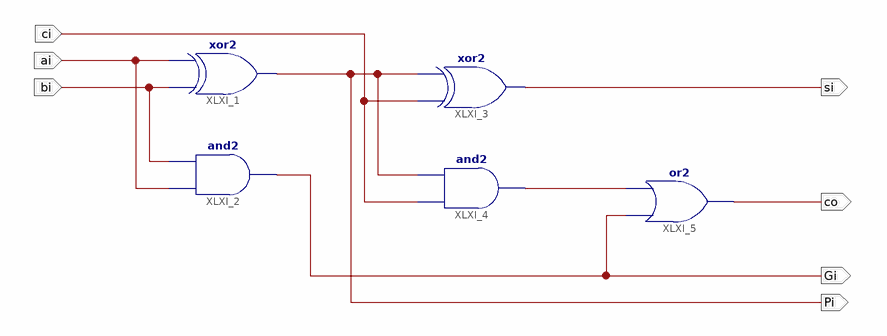
[diagram p0: schematic sheet 1]
// Xilinx ISE schematic add.sch (kintex7) as structural Verilog: 5 symbols, 7 ports
module add (
  input  ai,
  input  bi,
  input  ci,
  output Pi,
  output Gi,
  output co,
  output si
);

  wire XLXN_8;

  xor XLXI_1 (Pi, bi, ai);
  and XLXI_2 (Gi, ai, bi);
  xor XLXI_3 (si, ci, Pi);
  and XLXI_4 (XLXN_8, ci, Pi);
  or XLXI_5 (co, Gi, XLXN_8);
endmodule
